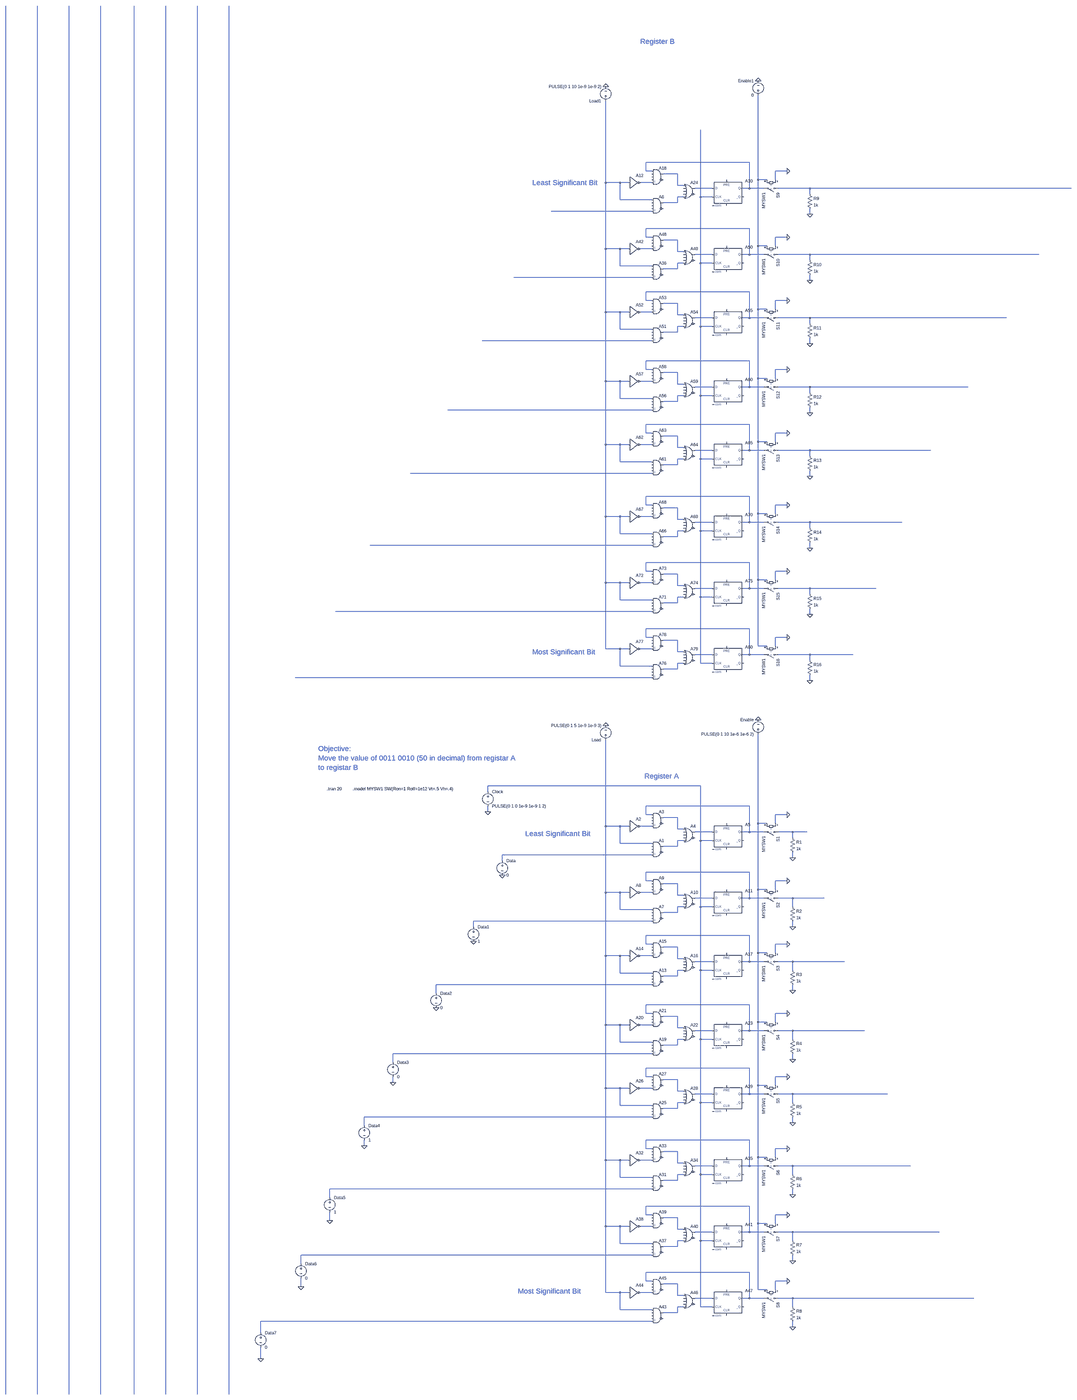
[diagram p0: schematic 8 Bit Registers and ALU.asc, whole sheet]
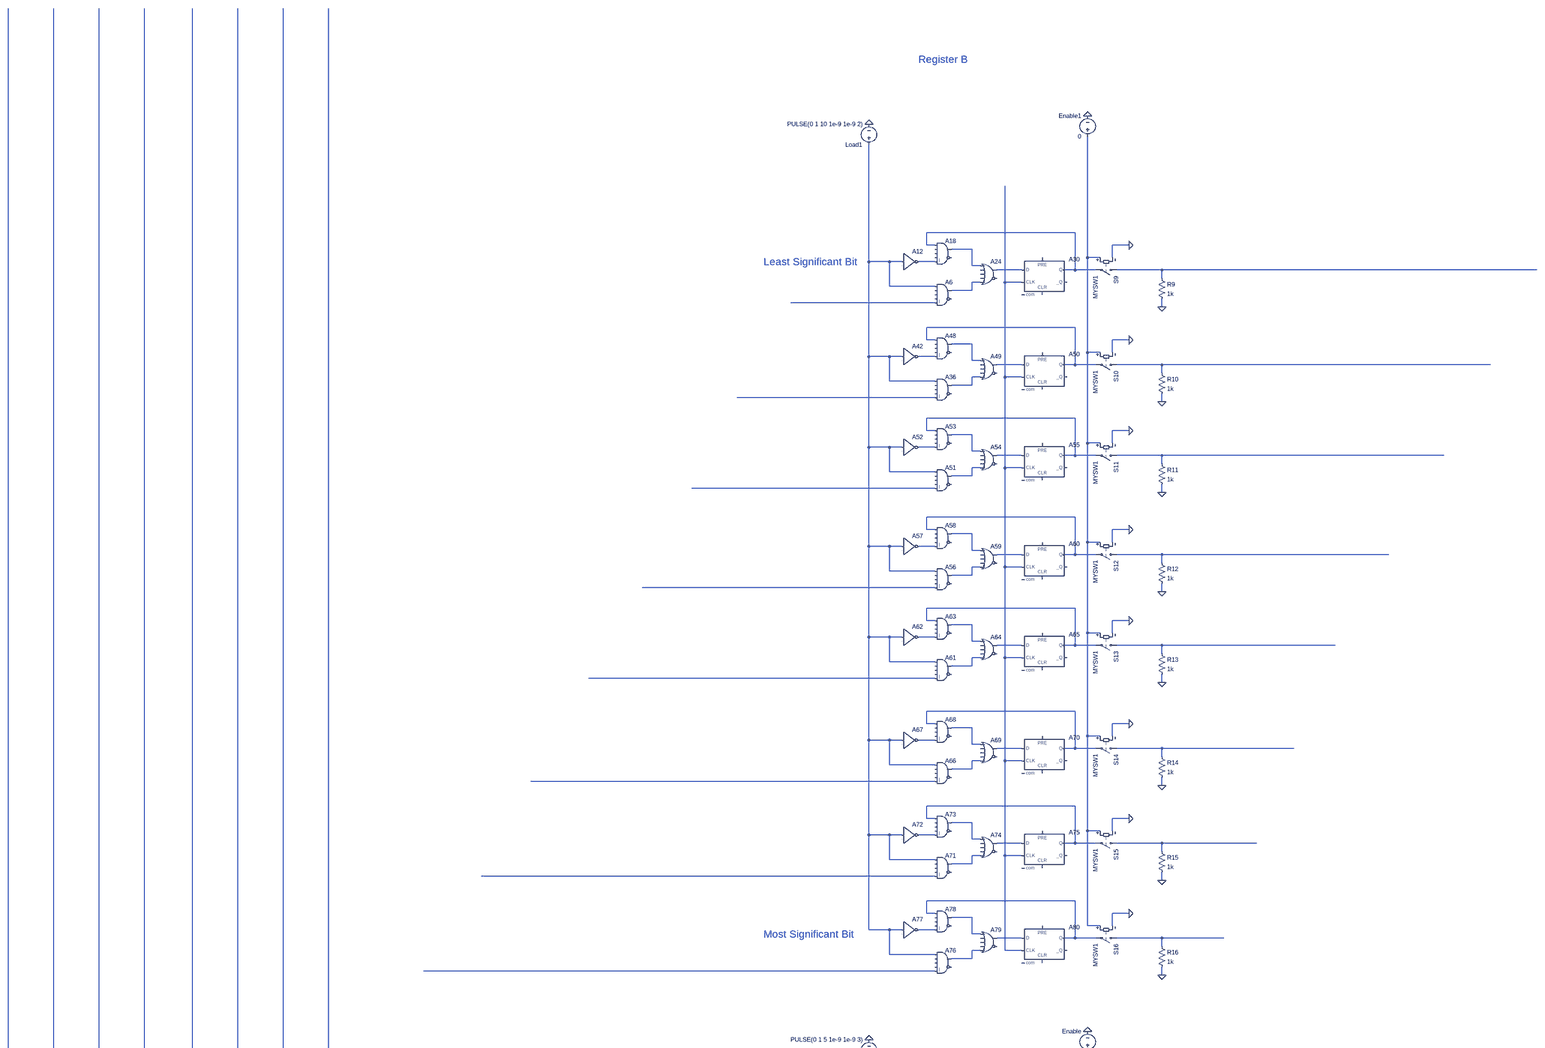
[diagram p1: schematic 8 Bit Registers and ALU.asc, part, row 1 of 2, column 1 of 1]
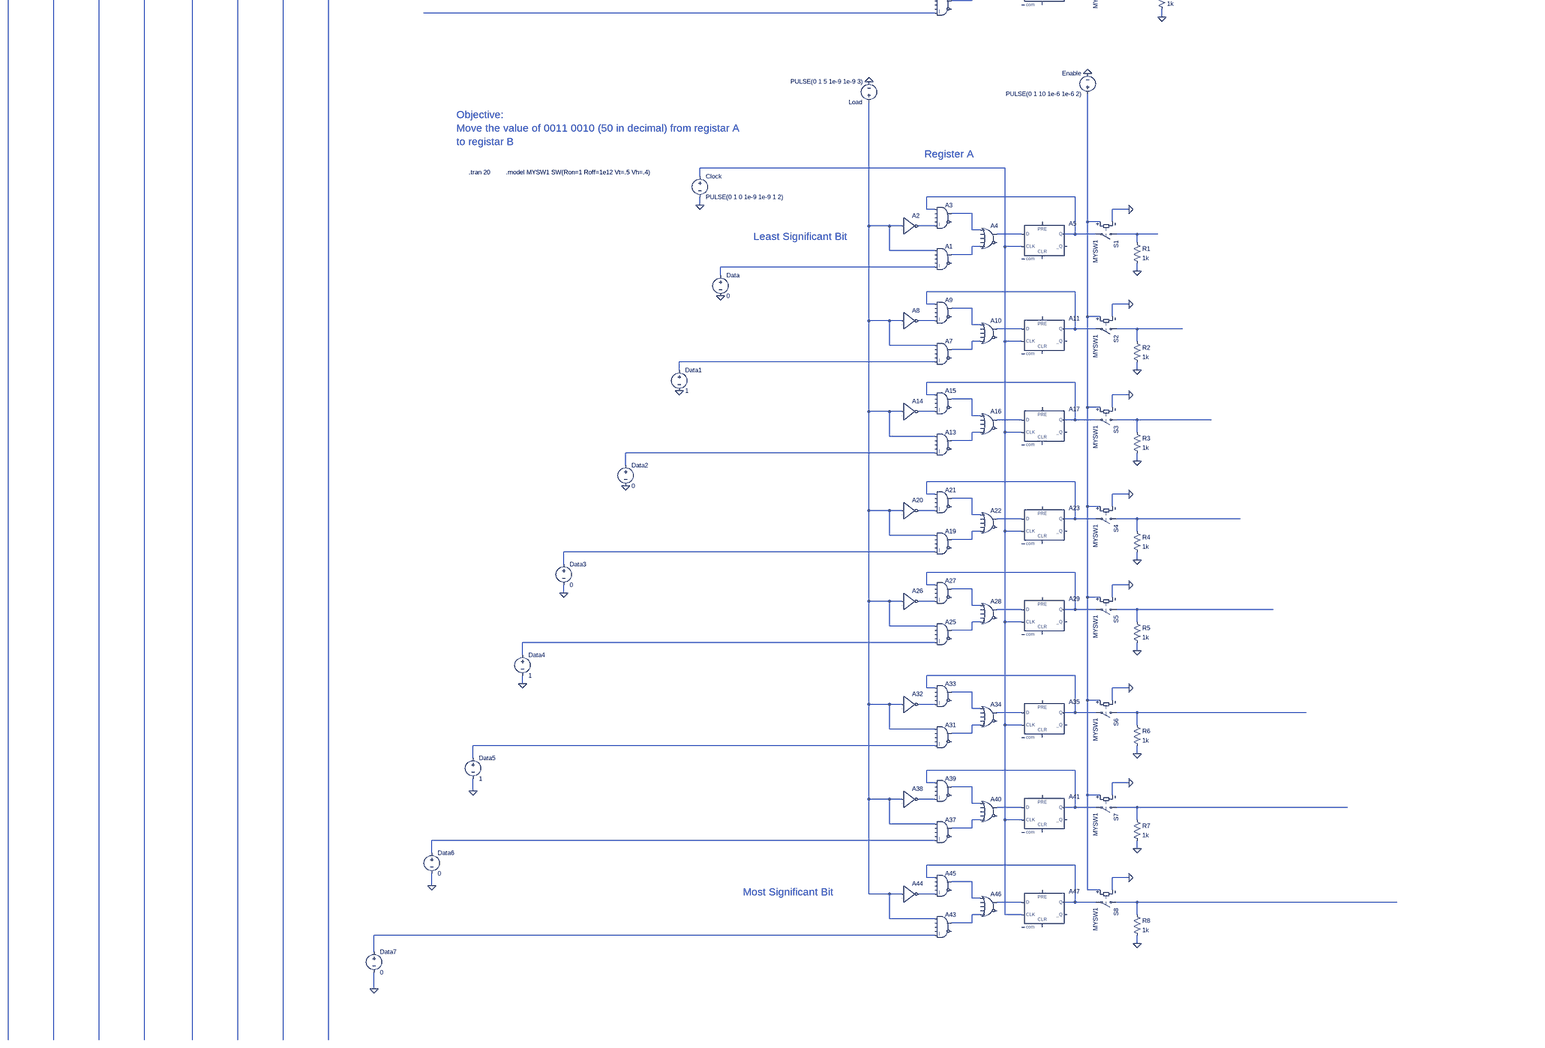
[diagram p2: schematic 8 Bit Registers and ALU.asc, part, row 2 of 2, column 1 of 1]
8 Bit Registers and ALU.asc, the LTspice schematic file:
Version 4
SHEET 1 12628 4260
WIRE -6800 -9184 -7376 -9184
WIRE -7376 -9136 -7376 -9184
WIRE -7344 -9136 -7376 -9136
WIRE -6592 -9136 -6656 -9136
WIRE -7200 -9120 -7280 -9120
WIRE -6752 -9088 -6752 -9584
WIRE -6704 -9088 -6752 -9088
WIRE -6656 -9088 -6656 -9136
WIRE -7600 -9072 -7600 -9552
WIRE -7520 -9072 -7600 -9072
WIRE -7472 -9072 -7520 -9072
WIRE -7344 -9072 -7408 -9072
WIRE -7200 -9056 -7200 -9120
WIRE -7168 -9056 -7200 -9056
WIRE -7008 -9040 -7104 -9040
WIRE -6800 -9040 -6800 -9184
WIRE -6800 -9040 -6848 -9040
WIRE -6720 -9040 -6800 -9040
WIRE -6464 -9040 -6640 -9040
WIRE -4864 -9040 -6464 -9040
WIRE -6464 -9008 -6464 -9040
WIRE -7168 -8992 -7200 -8992
WIRE -7072 -8992 -7072 -9392
WIRE -7008 -8992 -7072 -8992
WIRE -7520 -8976 -7520 -9072
WIRE -7344 -8976 -7520 -8976
WIRE -7200 -8960 -7200 -8992
WIRE -7200 -8960 -7280 -8960
WIRE -7344 -8912 -7904 -8912
WIRE -6464 -8896 -6464 -8928
WIRE -6800 -8816 -7376 -8816
WIRE -7376 -8768 -7376 -8816
WIRE -7344 -8768 -7376 -8768
WIRE -6592 -8768 -6656 -8768
WIRE -7200 -8752 -7280 -8752
WIRE -6752 -8720 -6752 -9088
WIRE -6704 -8720 -6752 -8720
WIRE -6656 -8720 -6656 -8768
WIRE -7600 -8704 -7600 -9072
WIRE -7520 -8704 -7600 -8704
WIRE -7472 -8704 -7520 -8704
WIRE -7344 -8704 -7408 -8704
WIRE -7200 -8688 -7200 -8752
WIRE -7168 -8688 -7200 -8688
WIRE -7008 -8672 -7104 -8672
WIRE -6800 -8672 -6800 -8816
WIRE -6800 -8672 -6848 -8672
WIRE -6720 -8672 -6800 -8672
WIRE -6464 -8672 -6640 -8672
WIRE -5120 -8672 -6464 -8672
WIRE -6464 -8640 -6464 -8672
WIRE -7168 -8624 -7200 -8624
WIRE -7072 -8624 -7072 -8992
WIRE -7008 -8624 -7072 -8624
WIRE -7520 -8608 -7520 -8704
WIRE -7344 -8608 -7520 -8608
WIRE -7200 -8592 -7200 -8624
WIRE -7200 -8592 -7280 -8592
WIRE -7344 -8544 -8112 -8544
WIRE -6464 -8528 -6464 -8560
WIRE -6800 -8464 -7376 -8464
WIRE -7376 -8416 -7376 -8464
WIRE -7344 -8416 -7376 -8416
WIRE -6592 -8416 -6656 -8416
WIRE -7200 -8400 -7280 -8400
WIRE -6752 -8368 -6752 -8720
WIRE -6704 -8368 -6752 -8368
WIRE -6656 -8368 -6656 -8416
WIRE -7600 -8352 -7600 -8704
WIRE -7520 -8352 -7600 -8352
WIRE -7472 -8352 -7520 -8352
WIRE -7344 -8352 -7408 -8352
WIRE -7200 -8336 -7200 -8400
WIRE -7168 -8336 -7200 -8336
WIRE -7008 -8320 -7104 -8320
WIRE -6800 -8320 -6800 -8464
WIRE -6800 -8320 -6848 -8320
WIRE -6720 -8320 -6800 -8320
WIRE -6464 -8320 -6640 -8320
WIRE -5344 -8320 -6464 -8320
WIRE -6464 -8288 -6464 -8320
WIRE -7168 -8272 -7200 -8272
WIRE -7072 -8272 -7072 -8624
WIRE -7008 -8272 -7072 -8272
WIRE -7520 -8256 -7520 -8352
WIRE -7344 -8256 -7520 -8256
WIRE -7200 -8240 -7200 -8272
WIRE -7200 -8240 -7280 -8240
WIRE -7344 -8192 -8288 -8192
WIRE -6464 -8176 -6464 -8208
WIRE -6800 -8080 -7376 -8080
WIRE -7376 -8032 -7376 -8080
WIRE -7344 -8032 -7376 -8032
WIRE -6592 -8032 -6656 -8032
WIRE -7200 -8016 -7280 -8016
WIRE -6752 -7984 -6752 -8368
WIRE -6704 -7984 -6752 -7984
WIRE -6656 -7984 -6656 -8032
WIRE -7600 -7968 -7600 -8352
WIRE -7520 -7968 -7600 -7968
WIRE -7472 -7968 -7520 -7968
WIRE -7344 -7968 -7408 -7968
WIRE -7200 -7952 -7200 -8016
WIRE -7168 -7952 -7200 -7952
WIRE -7008 -7936 -7104 -7936
WIRE -6800 -7936 -6800 -8080
WIRE -6800 -7936 -6848 -7936
WIRE -6720 -7936 -6800 -7936
WIRE -6464 -7936 -6640 -7936
WIRE -5584 -7936 -6464 -7936
WIRE -6464 -7904 -6464 -7936
WIRE -7168 -7888 -7200 -7888
WIRE -7072 -7888 -7072 -8272
WIRE -7008 -7888 -7072 -7888
WIRE -7520 -7872 -7520 -7968
WIRE -7344 -7872 -7520 -7872
WIRE -7200 -7856 -7200 -7888
WIRE -7200 -7856 -7280 -7856
WIRE -7344 -7808 -8480 -7808
WIRE -6464 -7792 -6464 -7824
WIRE -6800 -7728 -7376 -7728
WIRE -7376 -7680 -7376 -7728
WIRE -7344 -7680 -7376 -7680
WIRE -6592 -7680 -6656 -7680
WIRE -7200 -7664 -7280 -7664
WIRE -6752 -7632 -6752 -7984
WIRE -6704 -7632 -6752 -7632
WIRE -6656 -7632 -6656 -7680
WIRE -7600 -7616 -7600 -7968
WIRE -7520 -7616 -7600 -7616
WIRE -7472 -7616 -7520 -7616
WIRE -7344 -7616 -7408 -7616
WIRE -7200 -7600 -7200 -7664
WIRE -7168 -7600 -7200 -7600
WIRE -7008 -7584 -7104 -7584
WIRE -6800 -7584 -6800 -7728
WIRE -6800 -7584 -6848 -7584
WIRE -6720 -7584 -6800 -7584
WIRE -6464 -7584 -6640 -7584
WIRE -5792 -7584 -6464 -7584
WIRE -6464 -7552 -6464 -7584
WIRE -7168 -7536 -7200 -7536
WIRE -7072 -7536 -7072 -7888
WIRE -7008 -7536 -7072 -7536
WIRE -7520 -7520 -7520 -7616
WIRE -7344 -7520 -7520 -7520
WIRE -7200 -7504 -7200 -7536
WIRE -7200 -7504 -7280 -7504
WIRE -7344 -7456 -8688 -7456
WIRE -6464 -7440 -6464 -7472
WIRE -6800 -7328 -7376 -7328
WIRE -7376 -7280 -7376 -7328
WIRE -7344 -7280 -7376 -7280
WIRE -6592 -7280 -6656 -7280
WIRE -7200 -7264 -7280 -7264
WIRE -6752 -7232 -6752 -7632
WIRE -6704 -7232 -6752 -7232
WIRE -6656 -7232 -6656 -7280
WIRE -7600 -7216 -7600 -7616
WIRE -7520 -7216 -7600 -7216
WIRE -7472 -7216 -7520 -7216
WIRE -7344 -7216 -7408 -7216
WIRE -7200 -7200 -7200 -7264
WIRE -7168 -7200 -7200 -7200
WIRE -7008 -7184 -7104 -7184
WIRE -6800 -7184 -6800 -7328
WIRE -6800 -7184 -6848 -7184
WIRE -6720 -7184 -6800 -7184
WIRE -6464 -7184 -6640 -7184
WIRE -5952 -7184 -6464 -7184
WIRE -6464 -7152 -6464 -7184
WIRE -7168 -7136 -7200 -7136
WIRE -7072 -7136 -7072 -7536
WIRE -7008 -7136 -7072 -7136
WIRE -7520 -7120 -7520 -7216
WIRE -7344 -7120 -7520 -7120
WIRE -7200 -7104 -7200 -7136
WIRE -7200 -7104 -7280 -7104
WIRE -7344 -7056 -8912 -7056
WIRE -6464 -7040 -6464 -7072
WIRE -6800 -6960 -7376 -6960
WIRE -7376 -6912 -7376 -6960
WIRE -7344 -6912 -7376 -6912
WIRE -6592 -6912 -6656 -6912
WIRE -7200 -6896 -7280 -6896
WIRE -6752 -6864 -6752 -7232
WIRE -6704 -6864 -6752 -6864
WIRE -6656 -6864 -6656 -6912
WIRE -7600 -6848 -7600 -7216
WIRE -7520 -6848 -7600 -6848
WIRE -7472 -6848 -7520 -6848
WIRE -7344 -6848 -7408 -6848
WIRE -7200 -6832 -7200 -6896
WIRE -7168 -6832 -7200 -6832
WIRE -7008 -6816 -7104 -6816
WIRE -6800 -6816 -6800 -6960
WIRE -6800 -6816 -6848 -6816
WIRE -6720 -6816 -6800 -6816
WIRE -6464 -6816 -6640 -6816
WIRE -6096 -6816 -6464 -6816
WIRE -6464 -6784 -6464 -6816
WIRE -7168 -6768 -7200 -6768
WIRE -7072 -6768 -7072 -7136
WIRE -7008 -6768 -7072 -6768
WIRE -7520 -6752 -7520 -6848
WIRE -7344 -6752 -7520 -6752
WIRE -7200 -6736 -7200 -6768
WIRE -7200 -6736 -7280 -6736
WIRE -7344 -6688 -9104 -6688
WIRE -6464 -6672 -6464 -6704
WIRE -6800 -6592 -7376 -6592
WIRE -7376 -6544 -7376 -6592
WIRE -7344 -6544 -7376 -6544
WIRE -6592 -6544 -6656 -6544
WIRE -7200 -6528 -7280 -6528
WIRE -6752 -6496 -6752 -6864
WIRE -6704 -6496 -6752 -6496
WIRE -6656 -6496 -6656 -6544
WIRE -7600 -6480 -7600 -6848
WIRE -7520 -6480 -7600 -6480
WIRE -7472 -6480 -7520 -6480
WIRE -7344 -6480 -7408 -6480
WIRE -7200 -6464 -7200 -6528
WIRE -7168 -6464 -7200 -6464
WIRE -7008 -6448 -7104 -6448
WIRE -6800 -6448 -6800 -6592
WIRE -6800 -6448 -6848 -6448
WIRE -6720 -6448 -6800 -6448
WIRE -6464 -6448 -6640 -6448
WIRE -6224 -6448 -6464 -6448
WIRE -6464 -6416 -6464 -6448
WIRE -7168 -6400 -7200 -6400
WIRE -7072 -6400 -7072 -6768
WIRE -7008 -6400 -7072 -6400
WIRE -7520 -6384 -7520 -6480
WIRE -7344 -6384 -7520 -6384
WIRE -7200 -6368 -7200 -6400
WIRE -7200 -6368 -7280 -6368
WIRE -7344 -6320 -9328 -6320
WIRE -6464 -6304 -6464 -6336
WIRE -7072 816 -8256 816
WIRE -8256 848 -8256 816
WIRE -6800 928 -7376 928
WIRE -8256 960 -8256 928
WIRE -7376 976 -7376 928
WIRE -7344 976 -7376 976
WIRE -6592 976 -6656 976
WIRE -7200 992 -7280 992
WIRE -6752 1024 -6752 528
WIRE -6704 1024 -6752 1024
WIRE -6656 1024 -6656 976
WIRE -7600 1040 -7600 560
WIRE -7520 1040 -7600 1040
WIRE -7472 1040 -7520 1040
WIRE -7344 1040 -7408 1040
WIRE -7200 1056 -7200 992
WIRE -7168 1056 -7200 1056
WIRE -7008 1072 -7104 1072
WIRE -6800 1072 -6800 928
WIRE -6800 1072 -6848 1072
WIRE -6720 1072 -6800 1072
WIRE -6560 1072 -6640 1072
WIRE -6480 1072 -6560 1072
WIRE -6560 1104 -6560 1072
WIRE -7168 1120 -7200 1120
WIRE -7072 1120 -7072 816
WIRE -7008 1120 -7072 1120
WIRE -7520 1136 -7520 1040
WIRE -7344 1136 -7520 1136
WIRE -7200 1152 -7200 1120
WIRE -7200 1152 -7280 1152
WIRE -7344 1200 -8176 1200
WIRE -6560 1216 -6560 1184
WIRE -8176 1232 -8176 1200
WIRE -6800 1296 -7376 1296
WIRE -7376 1344 -7376 1296
WIRE -7344 1344 -7376 1344
WIRE -6592 1344 -6656 1344
WIRE -7200 1360 -7280 1360
WIRE -6752 1392 -6752 1024
WIRE -6704 1392 -6752 1392
WIRE -6656 1392 -6656 1344
WIRE -7600 1408 -7600 1040
WIRE -7520 1408 -7600 1408
WIRE -7472 1408 -7520 1408
WIRE -7344 1408 -7408 1408
WIRE -7200 1424 -7200 1360
WIRE -7168 1424 -7200 1424
WIRE -7008 1440 -7104 1440
WIRE -6800 1440 -6800 1296
WIRE -6800 1440 -6848 1440
WIRE -6720 1440 -6800 1440
WIRE -6560 1440 -6640 1440
WIRE -6384 1440 -6560 1440
WIRE -7168 1488 -7200 1488
WIRE -7072 1488 -7072 1120
WIRE -7008 1488 -7072 1488
WIRE -6560 1488 -6560 1440
WIRE -7520 1504 -7520 1408
WIRE -7344 1504 -7520 1504
WIRE -7200 1520 -7200 1488
WIRE -7200 1520 -7280 1520
WIRE -7344 1568 -8336 1568
WIRE -8336 1600 -8336 1568
WIRE -6560 1600 -6560 1568
WIRE -6800 1648 -7376 1648
WIRE -7376 1696 -7376 1648
WIRE -7344 1696 -7376 1696
WIRE -6592 1696 -6656 1696
WIRE -7200 1712 -7280 1712
WIRE -6752 1744 -6752 1392
WIRE -6704 1744 -6752 1744
WIRE -6656 1744 -6656 1696
WIRE -7600 1760 -7600 1408
WIRE -7520 1760 -7600 1760
WIRE -7472 1760 -7520 1760
WIRE -7344 1760 -7408 1760
WIRE -7200 1776 -7200 1712
WIRE -7168 1776 -7200 1776
WIRE -7008 1792 -7104 1792
WIRE -6800 1792 -6800 1648
WIRE -6800 1792 -6848 1792
WIRE -6720 1792 -6800 1792
WIRE -6560 1792 -6640 1792
WIRE -6272 1792 -6560 1792
WIRE -7168 1840 -7200 1840
WIRE -7072 1840 -7072 1488
WIRE -7008 1840 -7072 1840
WIRE -6560 1840 -6560 1792
WIRE -7520 1856 -7520 1760
WIRE -7344 1856 -7520 1856
WIRE -7200 1872 -7200 1840
WIRE -7200 1872 -7280 1872
WIRE -7344 1920 -8544 1920
WIRE -6560 1952 -6560 1920
WIRE -8544 1968 -8544 1920
WIRE -6800 2032 -7376 2032
WIRE -7376 2080 -7376 2032
WIRE -7344 2080 -7376 2080
WIRE -6592 2080 -6656 2080
WIRE -7200 2096 -7280 2096
WIRE -6752 2128 -6752 1744
WIRE -6704 2128 -6752 2128
WIRE -6656 2128 -6656 2080
WIRE -7600 2144 -7600 1760
WIRE -7520 2144 -7600 2144
WIRE -7472 2144 -7520 2144
WIRE -7344 2144 -7408 2144
WIRE -7200 2160 -7200 2096
WIRE -7168 2160 -7200 2160
WIRE -7008 2176 -7104 2176
WIRE -6800 2176 -6800 2032
WIRE -6800 2176 -6848 2176
WIRE -6720 2176 -6800 2176
WIRE -6560 2176 -6640 2176
WIRE -6160 2176 -6560 2176
WIRE -7168 2224 -7200 2224
WIRE -7072 2224 -7072 1840
WIRE -7008 2224 -7072 2224
WIRE -6560 2224 -6560 2176
WIRE -7520 2240 -7520 2144
WIRE -7344 2240 -7520 2240
WIRE -7200 2256 -7200 2224
WIRE -7200 2256 -7280 2256
WIRE -7344 2304 -8784 2304
WIRE -6560 2336 -6560 2304
WIRE -8784 2352 -8784 2304
WIRE -6800 2384 -7376 2384
WIRE -7376 2432 -7376 2384
WIRE -7344 2432 -7376 2432
WIRE -6592 2432 -6656 2432
WIRE -7200 2448 -7280 2448
WIRE -8784 2464 -8784 2432
WIRE -6752 2480 -6752 2128
WIRE -6704 2480 -6752 2480
WIRE -6656 2480 -6656 2432
WIRE -7600 2496 -7600 2144
WIRE -7520 2496 -7600 2496
WIRE -7472 2496 -7520 2496
WIRE -7344 2496 -7408 2496
WIRE -7200 2512 -7200 2448
WIRE -7168 2512 -7200 2512
WIRE -7008 2528 -7104 2528
WIRE -6800 2528 -6800 2384
WIRE -6800 2528 -6848 2528
WIRE -6720 2528 -6800 2528
WIRE -6560 2528 -6640 2528
WIRE -6032 2528 -6560 2528
WIRE -7168 2576 -7200 2576
WIRE -7072 2576 -7072 2224
WIRE -7008 2576 -7072 2576
WIRE -6560 2576 -6560 2528
WIRE -7520 2592 -7520 2496
WIRE -7344 2592 -7520 2592
WIRE -7200 2608 -7200 2576
WIRE -7200 2608 -7280 2608
WIRE -7344 2656 -8944 2656
WIRE -6560 2688 -6560 2656
WIRE -8944 2704 -8944 2656
WIRE -6800 2784 -7376 2784
WIRE -8944 2816 -8944 2784
WIRE -7376 2832 -7376 2784
WIRE -7344 2832 -7376 2832
WIRE -6592 2832 -6656 2832
WIRE -7200 2848 -7280 2848
WIRE -6752 2880 -6752 2480
WIRE -6704 2880 -6752 2880
WIRE -6656 2880 -6656 2832
WIRE -7600 2896 -7600 2496
WIRE -7520 2896 -7600 2896
WIRE -7472 2896 -7520 2896
WIRE -7344 2896 -7408 2896
WIRE -7200 2912 -7200 2848
WIRE -7168 2912 -7200 2912
WIRE -7008 2928 -7104 2928
WIRE -6800 2928 -6800 2784
WIRE -6800 2928 -6848 2928
WIRE -6720 2928 -6800 2928
WIRE -6560 2928 -6640 2928
WIRE -5904 2928 -6560 2928
WIRE -7168 2976 -7200 2976
WIRE -7072 2976 -7072 2576
WIRE -7008 2976 -7072 2976
WIRE -6560 2976 -6560 2928
WIRE -7520 2992 -7520 2896
WIRE -7344 2992 -7520 2992
WIRE -7200 3008 -7200 2976
WIRE -7200 3008 -7280 3008
WIRE -7344 3056 -9136 3056
WIRE -6560 3088 -6560 3056
WIRE -9136 3104 -9136 3056
WIRE -6800 3152 -7376 3152
WIRE -7376 3200 -7376 3152
WIRE -7344 3200 -7376 3200
WIRE -6592 3200 -6656 3200
WIRE -7200 3216 -7280 3216
WIRE -9136 3232 -9136 3184
WIRE -6752 3248 -6752 2880
WIRE -6704 3248 -6752 3248
WIRE -6656 3248 -6656 3200
WIRE -7600 3264 -7600 2896
WIRE -7520 3264 -7600 3264
WIRE -7472 3264 -7520 3264
WIRE -7344 3264 -7408 3264
WIRE -7200 3280 -7200 3216
WIRE -7168 3280 -7200 3280
WIRE -7008 3296 -7104 3296
WIRE -6800 3296 -6800 3152
WIRE -6800 3296 -6848 3296
WIRE -6720 3296 -6800 3296
WIRE -6560 3296 -6640 3296
WIRE -5744 3296 -6560 3296
WIRE -7168 3344 -7200 3344
WIRE -7072 3344 -7072 2976
WIRE -7008 3344 -7072 3344
WIRE -6560 3344 -6560 3296
WIRE -7520 3360 -7520 3264
WIRE -7344 3360 -7520 3360
WIRE -7200 3376 -7200 3344
WIRE -7200 3376 -7280 3376
WIRE -7344 3424 -9296 3424
WIRE -6560 3456 -6560 3424
WIRE -9296 3472 -9296 3424
WIRE -6800 3520 -7376 3520
WIRE -7376 3568 -7376 3520
WIRE -7344 3568 -7376 3568
WIRE -6592 3568 -6656 3568
WIRE -7200 3584 -7280 3584
WIRE -9296 3600 -9296 3552
WIRE -6752 3616 -6752 3248
WIRE -6704 3616 -6752 3616
WIRE -6656 3616 -6656 3568
WIRE -7600 3632 -7600 3264
WIRE -7520 3632 -7600 3632
WIRE -7472 3632 -7520 3632
WIRE -7344 3632 -7408 3632
WIRE -7200 3648 -7200 3584
WIRE -7168 3648 -7200 3648
WIRE -7008 3664 -7104 3664
WIRE -6800 3664 -6800 3520
WIRE -6800 3664 -6848 3664
WIRE -6720 3664 -6800 3664
WIRE -6560 3664 -6640 3664
WIRE -5552 3664 -6560 3664
WIRE -7168 3712 -7200 3712
WIRE -7072 3712 -7072 3344
WIRE -7008 3712 -7072 3712
WIRE -6560 3712 -6560 3664
WIRE -7520 3728 -7520 3632
WIRE -7344 3728 -7520 3728
WIRE -7200 3744 -7200 3712
WIRE -7200 3744 -7280 3744
WIRE -7344 3792 -9520 3792
WIRE -6560 3824 -6560 3792
WIRE -9520 3856 -9520 3792
WIRE -9520 4000 -9520 3936
WIRE -10944 4256 -10944 -17712
WIRE -10768 4256 -10768 -17712
WIRE -10592 4256 -10592 -17712
WIRE -10416 4256 -10416 -17712
WIRE -10224 4256 -10224 -17712
WIRE -10048 4256 -10048 -17712
WIRE -9872 4256 -9872 -17712
WIRE -9696 4256 -9696 -17712
FLAG -8176 1312 0
FLAG -7600 480 0
FLAG -8336 1680 0
FLAG -8544 2048 0
FLAG -8784 2464 0
FLAG -8944 2816 0
FLAG -9136 3232 0
FLAG -9296 3600 0
FLAG -9520 4000 0
FLAG -6592 976 0
FLAG -6752 448 0
FLAG -6592 1344 0
FLAG -6592 1696 0
FLAG -6592 2080 0
FLAG -6592 2432 0
FLAG -6592 2832 0
FLAG -6592 3200 0
FLAG -6592 3568 0
FLAG -7600 -9632 0
FLAG -6592 -9136 0
FLAG -6752 -9664 0
FLAG -6592 -8768 0
FLAG -6592 -8416 0
FLAG -6592 -8032 0
FLAG -6592 -7680 0
FLAG -6592 -7280 0
FLAG -6592 -6912 0
FLAG -6592 -6544 0
FLAG -6560 1216 0
FLAG -6560 1600 0
FLAG -6560 1952 0
FLAG -6560 2336 0
FLAG -6560 2688 0
FLAG -6560 3088 0
FLAG -6560 3456 0
FLAG -6560 3824 0
FLAG -8256 960 0
FLAG -6464 -8896 0
FLAG -6464 -8528 0
FLAG -6464 -8176 0
FLAG -6464 -7792 0
FLAG -6464 -7440 0
FLAG -6464 -7040 0
FLAG -6464 -6672 0
FLAG -6464 -6304 0
SYMBOL voltage -8176 1216 R0
WINDOW 123 0 0 Left 0
WINDOW 39 0 0 Left 0
SYMATTR InstName Data
SYMATTR Value 0
SYMBOL voltage -7600 576 R180
WINDOW 123 0 0 Left 0
WINDOW 39 0 0 Left 0
SYMATTR InstName Load
SYMATTR Value PULSE(0 1 5 1e-9 1e-9 3)
SYMBOL Digital\\and -7312 1104 R0
SYMATTR InstName A1
SYMBOL Digital\\inv -7472 976 R0
SYMATTR InstName A2
SYMBOL Digital\\and -7312 944 R0
SYMATTR InstName A3
SYMBOL Digital\\or -7136 1024 R0
SYMATTR InstName A4
SYMBOL Digital\\dflop -6928 1024 R0
SYMATTR InstName A5
SYMBOL voltage -8256 832 R0
WINDOW 123 0 0 Left 0
WINDOW 39 0 0 Left 0
SYMATTR InstName Clock
SYMATTR Value PULSE(0 1 0 1e-9 1e-9 1 2)
SYMBOL Digital\\and -7312 1472 R0
SYMATTR InstName A7
SYMBOL Digital\\inv -7472 1344 R0
SYMATTR InstName A8
SYMBOL Digital\\and -7312 1312 R0
SYMATTR InstName A9
SYMBOL Digital\\or -7136 1392 R0
SYMATTR InstName A10
SYMBOL Digital\\dflop -6928 1392 R0
SYMATTR InstName A11
SYMBOL Digital\\and -7312 1824 R0
SYMATTR InstName A13
SYMBOL Digital\\inv -7472 1696 R0
SYMATTR InstName A14
SYMBOL Digital\\and -7312 1664 R0
SYMATTR InstName A15
SYMBOL Digital\\or -7136 1744 R0
SYMATTR InstName A16
SYMBOL Digital\\dflop -6928 1744 R0
SYMATTR InstName A17
SYMBOL Digital\\and -7312 2208 R0
SYMATTR InstName A19
SYMBOL Digital\\inv -7472 2080 R0
SYMATTR InstName A20
SYMBOL Digital\\and -7312 2048 R0
SYMATTR InstName A21
SYMBOL Digital\\or -7136 2128 R0
SYMATTR InstName A22
SYMBOL Digital\\dflop -6928 2128 R0
SYMATTR InstName A23
SYMBOL Digital\\and -7312 2560 R0
SYMATTR InstName A25
SYMBOL Digital\\inv -7472 2432 R0
SYMATTR InstName A26
SYMBOL Digital\\and -7312 2400 R0
SYMATTR InstName A27
SYMBOL Digital\\or -7136 2480 R0
SYMATTR InstName A28
SYMBOL Digital\\dflop -6928 2480 R0
SYMATTR InstName A29
SYMBOL Digital\\and -7312 2960 R0
SYMATTR InstName A31
SYMBOL Digital\\inv -7472 2832 R0
SYMATTR InstName A32
SYMBOL Digital\\and -7312 2800 R0
SYMATTR InstName A33
SYMBOL Digital\\or -7136 2880 R0
SYMATTR InstName A34
SYMBOL Digital\\dflop -6928 2880 R0
SYMATTR InstName A35
SYMBOL Digital\\and -7312 3328 R0
SYMATTR InstName A37
SYMBOL Digital\\inv -7472 3200 R0
SYMATTR InstName A38
SYMBOL Digital\\and -7312 3168 R0
SYMATTR InstName A39
SYMBOL Digital\\or -7136 3248 R0
SYMATTR InstName A40
SYMBOL Digital\\dflop -6928 3248 R0
SYMATTR InstName A41
SYMBOL Digital\\and -7312 3696 R0
SYMATTR InstName A43
SYMBOL Digital\\inv -7472 3568 R0
SYMATTR InstName A44
SYMBOL Digital\\and -7312 3536 R0
SYMATTR InstName A45
SYMBOL Digital\\or -7136 3616 R0
SYMATTR InstName A46
SYMBOL Digital\\dflop -6928 3616 R0
SYMATTR InstName A47
SYMBOL voltage -8336 1584 R0
WINDOW 123 0 0 Left 0
WINDOW 39 0 0 Left 0
SYMATTR InstName Data1
SYMATTR Value 1
SYMBOL voltage -8544 1952 R0
WINDOW 123 0 0 Left 0
WINDOW 39 0 0 Left 0
SYMATTR InstName Data2
SYMATTR Value 0
SYMBOL voltage -8784 2336 R0
WINDOW 123 0 0 Left 0
WINDOW 39 0 0 Left 0
SYMATTR InstName Data3
SYMATTR Value 0
SYMBOL voltage -8944 2688 R0
WINDOW 123 0 0 Left 0
WINDOW 39 0 0 Left 0
SYMATTR InstName Data4
SYMATTR Value 1
SYMBOL voltage -9136 3088 R0
WINDOW 123 0 0 Left 0
WINDOW 39 0 0 Left 0
SYMATTR InstName Data5
SYMATTR Value 1
SYMBOL voltage -9296 3456 R0
WINDOW 123 0 0 Left 0
WINDOW 39 0 0 Left 0
SYMATTR InstName Data6
SYMATTR Value 0
SYMBOL voltage -9520 3840 R0
WINDOW 123 0 0 Left 0
WINDOW 39 0 0 Left 0
SYMATTR InstName Data7
SYMATTR Value 0
SYMBOL voltage -6752 544 R180
WINDOW 0 24 96 Left 2
WINDOW 3 24 16 Left 2
WINDOW 123 0 0 Left 0
WINDOW 39 0 0 Left 0
SYMATTR InstName Enable
SYMATTR Value PULSE(0 1 10 1e-6 1e-6 2)
SYMBOL sw -6624 1072 R90
SYMATTR InstName S1
SYMATTR Value MYSW1
SYMBOL sw -6624 1440 R90
SYMATTR InstName S2
SYMATTR Value MYSW1
SYMBOL sw -6624 1792 R90
SYMATTR InstName S3
SYMATTR Value MYSW1
SYMBOL sw -6624 2176 R90
SYMATTR InstName S4
SYMATTR Value MYSW1
SYMBOL sw -6624 2528 R90
SYMATTR InstName S5
SYMATTR Value MYSW1
SYMBOL sw -6624 2928 R90
SYMATTR InstName S6
SYMATTR Value MYSW1
SYMBOL sw -6624 3296 R90
SYMATTR InstName S7
SYMATTR Value MYSW1
SYMBOL sw -6624 3664 R90
SYMATTR InstName S8
SYMATTR Value MYSW1
SYMBOL voltage -7600 -9536 R180
WINDOW 123 0 0 Left 0
WINDOW 39 0 0 Left 0
SYMATTR InstName Load1
SYMATTR Value PULSE(0 1 10 1e-9 1e-9 2)
SYMBOL Digital\\and -7312 -9008 R0
SYMATTR InstName A6
SYMBOL Digital\\inv -7472 -9136 R0
SYMATTR InstName A12
SYMBOL Digital\\and -7312 -9168 R0
SYMATTR InstName A18
SYMBOL Digital\\or -7136 -9088 R0
SYMATTR InstName A24
SYMBOL Digital\\dflop -6928 -9088 R0
SYMATTR InstName A30
SYMBOL Digital\\and -7312 -8640 R0
SYMATTR InstName A36
SYMBOL Digital\\inv -7472 -8768 R0
SYMATTR InstName A42
SYMBOL Digital\\and -7312 -8800 R0
SYMATTR InstName A48
SYMBOL Digital\\or -7136 -8720 R0
SYMATTR InstName A49
SYMBOL Digital\\dflop -6928 -8720 R0
SYMATTR InstName A50
SYMBOL Digital\\and -7312 -8288 R0
SYMATTR InstName A51
SYMBOL Digital\\inv -7472 -8416 R0
SYMATTR InstName A52
SYMBOL Digital\\and -7312 -8448 R0
SYMATTR InstName A53
SYMBOL Digital\\or -7136 -8368 R0
SYMATTR InstName A54
SYMBOL Digital\\dflop -6928 -8368 R0
SYMATTR InstName A55
SYMBOL Digital\\and -7312 -7904 R0
SYMATTR InstName A56
SYMBOL Digital\\inv -7472 -8032 R0
SYMATTR InstName A57
SYMBOL Digital\\and -7312 -8064 R0
SYMATTR InstName A58
SYMBOL Digital\\or -7136 -7984 R0
SYMATTR InstName A59
SYMBOL Digital\\dflop -6928 -7984 R0
SYMATTR InstName A60
SYMBOL Digital\\and -7312 -7552 R0
SYMATTR InstName A61
SYMBOL Digital\\inv -7472 -7680 R0
SYMATTR InstName A62
SYMBOL Digital\\and -7312 -7712 R0
SYMATTR InstName A63
SYMBOL Digital\\or -7136 -7632 R0
SYMATTR InstName A64
SYMBOL Digital\\dflop -6928 -7632 R0
SYMATTR InstName A65
SYMBOL Digital\\and -7312 -7152 R0
SYMATTR InstName A66
SYMBOL Digital\\inv -7472 -7280 R0
SYMATTR InstName A67
SYMBOL Digital\\and -7312 -7312 R0
SYMATTR InstName A68
SYMBOL Digital\\or -7136 -7232 R0
SYMATTR InstName A69
SYMBOL Digital\\dflop -6928 -7232 R0
SYMATTR InstName A70
SYMBOL Digital\\and -7312 -6784 R0
SYMATTR InstName A71
SYMBOL Digital\\inv -7472 -6912 R0
SYMATTR InstName A72
SYMBOL Digital\\and -7312 -6944 R0
SYMATTR InstName A73
SYMBOL Digital\\or -7136 -6864 R0
SYMATTR InstName A74
SYMBOL Digital\\dflop -6928 -6864 R0
SYMATTR InstName A75
SYMBOL Digital\\and -7312 -6416 R0
SYMATTR InstName A76
SYMBOL Digital\\inv -7472 -6544 R0
SYMATTR InstName A77
SYMBOL Digital\\and -7312 -6576 R0
SYMATTR InstName A78
SYMBOL Digital\\or -7136 -6496 R0
SYMATTR InstName A79
SYMBOL Digital\\dflop -6928 -6496 R0
SYMATTR InstName A80
SYMBOL voltage -6752 -9568 R180
WINDOW 0 24 96 Left 2
WINDOW 3 24 16 Left 2
WINDOW 123 0 0 Left 0
WINDOW 39 0 0 Left 0
SYMATTR InstName Enable1
SYMATTR Value 0
SYMBOL sw -6624 -9040 R90
SYMATTR InstName S9
SYMATTR Value MYSW1
SYMBOL sw -6624 -8672 R90
SYMATTR InstName S10
SYMATTR Value MYSW1
SYMBOL sw -6624 -8320 R90
SYMATTR InstName S11
SYMATTR Value MYSW1
SYMBOL sw -6624 -7936 R90
SYMATTR InstName S12
SYMATTR Value MYSW1
SYMBOL sw -6624 -7584 R90
SYMATTR InstName S13
SYMATTR Value MYSW1
SYMBOL sw -6624 -7184 R90
SYMATTR InstName S14
SYMATTR Value MYSW1
SYMBOL sw -6624 -6816 R90
SYMATTR InstName S15
SYMATTR Value MYSW1
SYMBOL sw -6624 -6448 R90
SYMATTR InstName S16
SYMATTR Value MYSW1
SYMBOL res -6576 1088 R0
SYMATTR InstName R1
SYMATTR Value 1k
SYMBOL res -6576 1472 R0
SYMATTR InstName R2
SYMATTR Value 1k
SYMBOL res -6576 1824 R0
SYMATTR InstName R3
SYMATTR Value 1k
SYMBOL res -6576 2208 R0
SYMATTR InstName R4
SYMATTR Value 1k
SYMBOL res -6576 2560 R0
SYMATTR InstName R5
SYMATTR Value 1k
SYMBOL res -6576 2960 R0
SYMATTR InstName R6
SYMATTR Value 1k
SYMBOL res -6576 3328 R0
SYMATTR InstName R7
SYMATTR Value 1k
SYMBOL res -6576 3696 R0
SYMATTR InstName R8
SYMATTR Value 1k
SYMBOL res -6480 -9024 R0
SYMATTR InstName R9
SYMATTR Value 1k
SYMBOL res -6480 -8656 R0
SYMATTR InstName R10
SYMATTR Value 1k
SYMBOL res -6480 -8304 R0
SYMATTR InstName R11
SYMATTR Value 1k
SYMBOL res -6480 -7920 R0
SYMATTR InstName R12
SYMATTR Value 1k
SYMBOL res -6480 -7568 R0
SYMATTR InstName R13
SYMATTR Value 1k
SYMBOL res -6480 -7168 R0
SYMATTR InstName R14
SYMATTR Value 1k
SYMBOL res -6480 -6800 R0
SYMATTR InstName R15
SYMATTR Value 1k
SYMBOL res -6480 -6432 R0
SYMATTR InstName R16
SYMATTR Value 1k
TEXT -9152 832 Left 2 !.tran 20
TEXT -7384 760 Left 4 ;Register A
TEXT -9008 832 Left 2 !.model MYSW1 SW(Ron=1 Roff=1e12 Vt=.5 Vh=.4)
TEXT -7408 -9896 Left 4 ;Register B
TEXT -8048 1080 Left 4 ;Least Significant Bit
TEXT -8088 3624 Left 4 ;Most Significant Bit
TEXT -9200 608 Left 4 ;Objective:\nMove the value of 0011 0010 (50 in decimal) from registar A\nto registar B
TEXT -8008 -9072 Left 4 ;Least Significant Bit
TEXT -8008 -6464 Left 4 ;Most Significant Bit

The netlist it stands for:
* 8 Bit Registers and ALU.asc
V§Data N069 0 0
V§Load N064 0 PULSE(0 1 5 1e-9 1e-9 3)
A1 N064 0 0 0 N069 0 N068 0 AND
A2 N064 0 0 0 0 N065 0 0 BUF
A3 N061 0 0 0 N065 0 N062 0 AND
A4 N062 0 0 0 N068 0 N066 0 OR
A5 N066 0 N060 0 0 0 N061 0 DFLOP
V§Clock N060 0 PULSE(0 1 0 1e-9 1e-9 1 2)
A7 N064 0 0 0 N076 0 N075 0 AND
A8 N064 0 0 0 0 N072 0 0 BUF
A9 N070 0 0 0 N072 0 N071 0 AND
A10 N071 0 0 0 N075 0 N073 0 OR
A11 N073 0 N060 0 0 0 N070 0 DFLOP
A13 N064 0 0 0 N083 0 N082 0 AND
A14 N064 0 0 0 0 N079 0 0 BUF
A15 N077 0 0 0 N079 0 N078 0 AND
A16 N078 0 0 0 N082 0 N080 0 OR
A17 N080 0 N060 0 0 0 N077 0 DFLOP
A19 N064 0 0 0 N090 0 N089 0 AND
A20 N064 0 0 0 0 N086 0 0 BUF
A21 N084 0 0 0 N086 0 N085 0 AND
A22 N085 0 0 0 N089 0 N087 0 OR
A23 N087 0 N060 0 0 0 N084 0 DFLOP
A25 N064 0 0 0 N097 0 N096 0 AND
A26 N064 0 0 0 0 N093 0 0 BUF
A27 N091 0 0 0 N093 0 N092 0 AND
A28 N092 0 0 0 N096 0 N094 0 OR
A29 N094 0 N060 0 0 0 N091 0 DFLOP
A31 N064 0 0 0 N104 0 N103 0 AND
A32 N064 0 0 0 0 N100 0 0 BUF
A33 N098 0 0 0 N100 0 N099 0 AND
A34 N099 0 0 0 N103 0 N101 0 OR
A35 N101 0 N060 0 0 0 N098 0 DFLOP
A37 N064 0 0 0 N111 0 N110 0 AND
A38 N064 0 0 0 0 N107 0 0 BUF
A39 N105 0 0 0 N107 0 N106 0 AND
A40 N106 0 0 0 N110 0 N108 0 OR
A41 N108 0 N060 0 0 0 N105 0 DFLOP
A43 N064 0 0 0 N118 0 N117 0 AND
A44 N064 0 0 0 0 N114 0 0 BUF
A45 N112 0 0 0 N114 0 N113 0 AND
A46 N113 0 0 0 N117 0 N115 0 OR
A47 N115 0 N060 0 0 0 N112 0 DFLOP
V§Data1 N076 0 1
V§Data2 N083 0 0
V§Data3 N090 0 0
V§Data4 N097 0 1
V§Data5 N104 0 1
V§Data6 N111 0 0
V§Data7 N118 0 0
V§Enable N063 0 PULSE(0 1 10 1e-6 1e-6 2)
S1 N067 N061 N063 0 MYSW1
S2 N074 N070 N063 0 MYSW1
S3 N081 N077 N063 0 MYSW1
S4 N088 N084 N063 0 MYSW1
S5 N095 N091 N063 0 MYSW1
S6 N102 N098 N063 0 MYSW1
S7 N109 N105 N063 0 MYSW1
S8 N116 N112 N063 0 MYSW1
V§Load1 N004 0 PULSE(0 1 10 1e-9 1e-9 2)
A6 N004 0 0 0 N010 0 N008 0 AND
A12 N004 0 0 0 0 N005 0 0 BUF
A18 N001 0 0 0 N005 0 N002 0 AND
A24 N002 0 0 0 N008 0 N006 0 OR
A30 N006 0 N009 0 0 0 N001 0 DFLOP
A36 N004 0 0 0 N017 0 N016 0 AND
A42 N004 0 0 0 0 N013 0 0 BUF
A48 N011 0 0 0 N013 0 N012 0 AND
A49 N012 0 0 0 N016 0 N014 0 OR
A50 N014 0 N009 0 0 0 N011 0 DFLOP
A51 N004 0 0 0 N024 0 N023 0 AND
A52 N004 0 0 0 0 N020 0 0 BUF
A53 N018 0 0 0 N020 0 N019 0 AND
A54 N019 0 0 0 N023 0 N021 0 OR
A55 N021 0 N009 0 0 0 N018 0 DFLOP
A56 N004 0 0 0 N031 0 N030 0 AND
A57 N004 0 0 0 0 N027 0 0 BUF
A58 N025 0 0 0 N027 0 N026 0 AND
A59 N026 0 0 0 N030 0 N028 0 OR
A60 N028 0 N009 0 0 0 N025 0 DFLOP
A61 N004 0 0 0 N038 0 N037 0 AND
A62 N004 0 0 0 0 N034 0 0 BUF
A63 N032 0 0 0 N034 0 N033 0 AND
A64 N033 0 0 0 N037 0 N035 0 OR
A65 N035 0 N009 0 0 0 N032 0 DFLOP
A66 N004 0 0 0 N045 0 N044 0 AND
A67 N004 0 0 0 0 N041 0 0 BUF
A68 N039 0 0 0 N041 0 N040 0 AND
A69 N040 0 0 0 N044 0 N042 0 OR
A70 N042 0 N009 0 0 0 N039 0 DFLOP
A71 N004 0 0 0 N052 0 N051 0 AND
A72 N004 0 0 0 0 N048 0 0 BUF
A73 N046 0 0 0 N048 0 N047 0 AND
A74 N047 0 0 0 N051 0 N049 0 OR
A75 N049 0 N009 0 0 0 N046 0 DFLOP
A76 N004 0 0 0 N059 0 N058 0 AND
A77 N004 0 0 0 0 N055 0 0 BUF
A78 N053 0 0 0 N055 0 N054 0 AND
A79 N054 0 0 0 N058 0 N056 0 OR
A80 N056 0 N009 0 0 0 N053 0 DFLOP
V§Enable1 N003 0 0
S9 N007 N001 N003 0 MYSW1
S10 N015 N011 N003 0 MYSW1
S11 N022 N018 N003 0 MYSW1
S12 N029 N025 N003 0 MYSW1
S13 N036 N032 N003 0 MYSW1
S14 N043 N039 N003 0 MYSW1
S15 N050 N046 N003 0 MYSW1
S16 N057 N053 N003 0 MYSW1
R1 N067 0 1k
R2 N074 0 1k
R3 N081 0 1k
R4 N088 0 1k
R5 N095 0 1k
R6 N102 0 1k
R7 N109 0 1k
R8 N116 0 1k
R9 N007 0 1k
R10 N015 0 1k
R11 N022 0 1k
R12 N029 0 1k
R13 N036 0 1k
R14 N043 0 1k
R15 N050 0 1k
R16 N057 0 1k
.tran 20
* Register A
.model MYSW1 SW(Ron=1 Roff=1e12 Vt=.5 Vh=.4)
* Register B
* Least Significant Bit
* Most Significant Bit
* Objective:
* Move the value of 0011 0010 (50 in decimal) from registar A
* to registar B
* Least Significant Bit
* Most Significant Bit
.backanno
.end